# Altium schematic sheet ethernet.SchDoc: Ethernet
size A3; Organization: Tweetonig; Address1: Delftsestraat 11; DocumentNumber: 7; Revision: 1.0; SheetNumber: 7; SheetTotal: 9
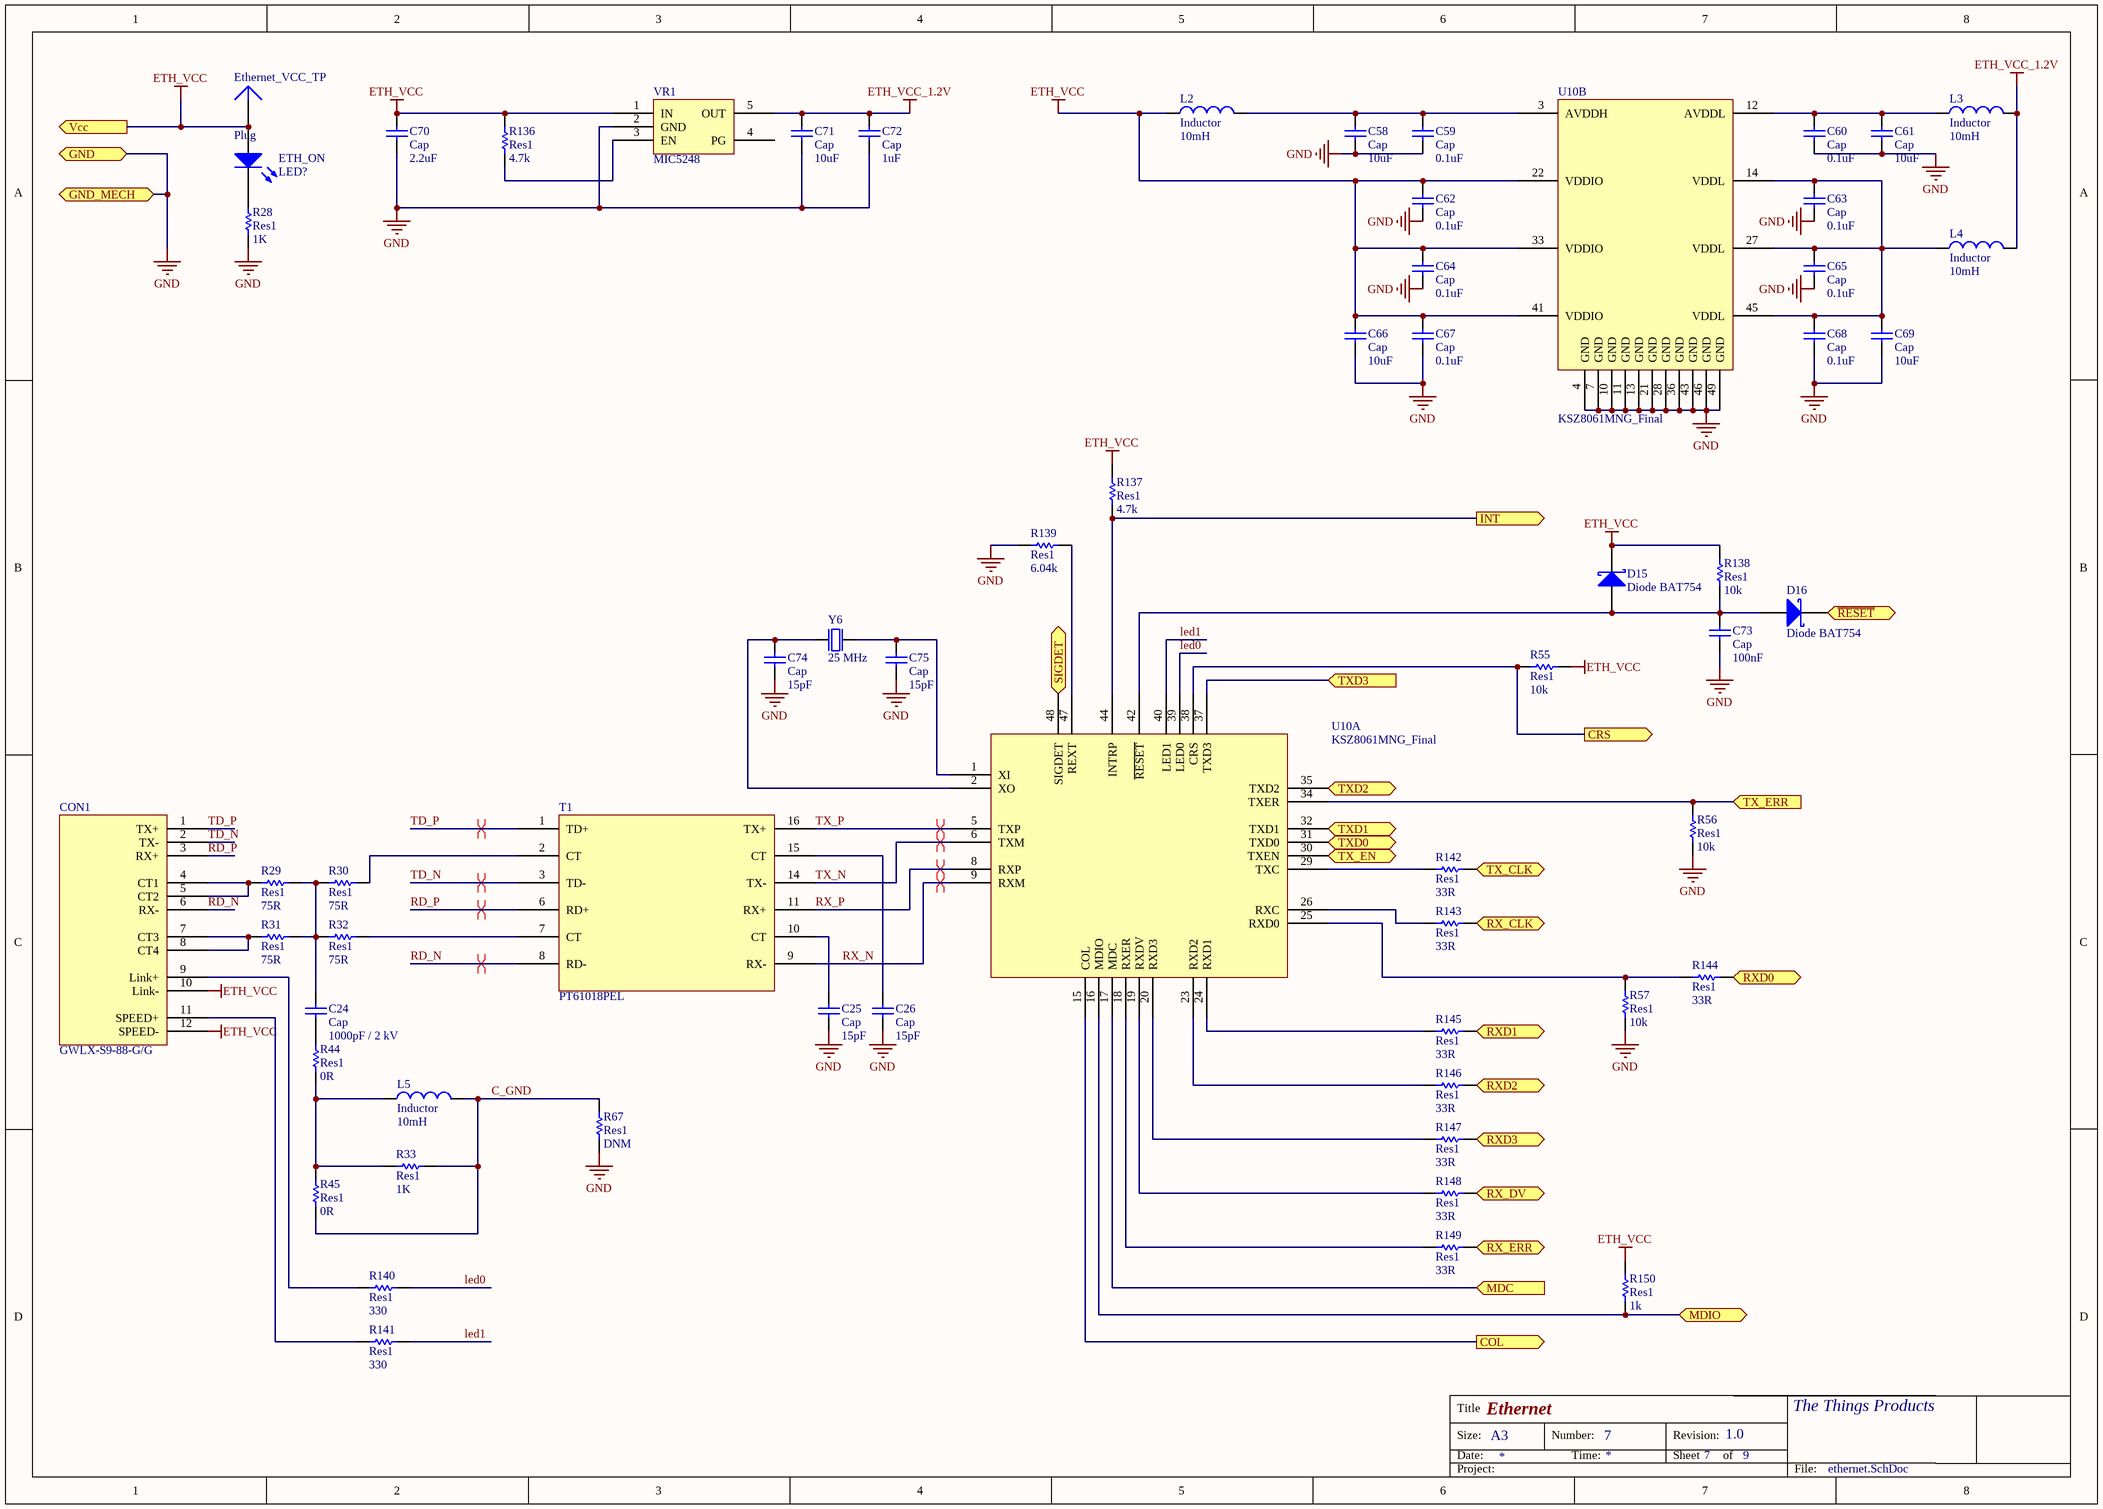
[diagram p0: ethernet.SchDoc]

## Parts
C24  Cap  value 1000pF / 2 kV  [CAP HV 5-7.5mm]
C25  Cap  value 15pF  [C0603]
C26  Cap  value 15pF  [C0603]
C58  Cap  value 10uF  [C0603]
C59  Cap  value 0.1uF  [C0603]
C60  Cap  value 0.1uF  [C0603]
C61  Cap  value 10uF  [C0603]
C62  Cap  value 0.1uF  [C0603]
C63  Cap  value 0.1uF  [C0603]
C64  Cap  value 0.1uF  [C0603]
C65  Cap  value 0.1uF  [C0603]
C66  Cap  value 10uF  [C0603]
C67  Cap  value 0.1uF  [C0603]
C68  Cap  value 0.1uF  [C0603]
C69  Cap  value 10uF  [C0603]
C70  Cap  value 2.2uF  [C0603]
C71  Cap  value 10uF  [C0603]
C72  Cap  value 1uF  [C0603]
C73  Cap  value 100nF  [C0603]
C74  Cap  value 15pF  [C0603]
C75  Cap  value 15pF  [C0603]
CON1  GWLX-S9-88-G/G  [GWLX-S9-88-G/G]
D15  Diode BAT754  [SOT-23_N]
D16  Diode BAT754  [SOT-23_N]
ETH_ON  LED?  [C0603]
Ethernet_VCC_TP  Plug  [PIN1]
L2  Inductor  value 10mH  [6-0805_L]
L3  Inductor  value 10mH  [6-0805_L]
L4  Inductor  value 10mH  [6-0805_L]
L5  Inductor  value 10mH  [6-0805_L]
R28  Res1  value 1K  [R0603]
R29  Res1  value 75R  [R0603]
R30  Res1  value 75R  [R0603]
R31  Res1  value 75R  [R0603]
R32  Res1  value 75R  [R0603]
R33  Res1  value 1K  [R0603]
R44  Res1  value 0R  [R0603]
R45  Res1  value 0R  [R0603]
R55  Res1  value 10k  [R0603]
R56  Res1  value 10k  [R0603]
R57  Res1  value 10k  [R0603]
R67  Res1  value DNM  [R0603]
R136  Res1  value 4.7k  [R0603]
R137  Res1  value 4.7k  [R0603]
R138  Res1  value 10k  [R0603]
R139  Res1  value 6.04k  [R0603]
R140  Res1  value 330  [R0603]
R141  Res1  value 330  [R0603]
R142  Res1  value 33R  [R0603]
R143  Res1  value 33R  [R0603]
R144  Res1  value 33R  [R0603]
R145  Res1  value 33R  [R0603]
R146  Res1  value 33R  [R0603]
R147  Res1  value 33R  [R0603]
R148  Res1  value 33R  [R0603]
R149  Res1  value 33R  [R0603]
R150  Res1  value 1k  [R0603]
T1  PT61018PEL  [WSOIC16_L]
U10  KSZ8061MNG_Final  (parts A,B of 2)
VR1  MIC5248  [SOT23-5_L]
Y6  25 MHz  [Crystal - ABM3B]

## Ports
COL (out), CRS (out), GND (bidir), GND_MECH (bidir), INT (out), MDC (in), MDIO, RX_CLK (out), RX_DV (out), RX_ERR (out), RXD0 (out), RXD1 (out), RXD2 (out), RXD3 (out), SIGDET (out), TX_CLK (out), TX_EN (in), TX_ERR (in), TXD0 (in), TXD1 (in), TXD2 (in), TXD3 (in), Vcc (out), ~{RESET}

## Nets
ETH_VCC: C62.2 C64.2 C66.2 C67.2 C70.2 CON1.10(Link-) CON1.12(SPEED-) D15.3(K) ETH_ON.1(A) Ethernet_VCC_TP.1 L2.1 R55.1 R136.2 R137.2 R138.2 R150.2 U10.22(VDDIO) U10.33(VDDIO) U10.41(VDDIO) VR1.1(IN) ; port Vcc
ETH_VCC_1.2V: C71.2 C72.2 L3.2 L4.2 VR1.5(OUT)
GND: C25.1 C26.1 C58.1 C59.1 C60.1 C61.1 C62.1 C63.1 C64.1 C65.1 C66.1 C67.1 C68.1 C69.1 C70.1 C71.1 C72.1 C73.1 C74.1 C75.1 R28.1 R56.1 R57.1 R67.2 R139.1 U10.4(GND) U10.7(GND) U10.10(GND) U10.11(GND) U10.13(GND) U10.21(GND) U10.28(GND) U10.36(GND) U10.43(GND) U10.46(GND) U10.49(GND) VR1.2(GND) Y6.2(GND) Y6.4(GND) ; port GND, port GND_MECH
~{RESET}: D16.3(K) ; port ~{RESET}
C_GND: L5.2 R33.2 R45.2 R67.1
COL: U10.15(COL) ; port COL
CRS: R55.2 U10.38(CRS) ; port CRS
INT: R137.1 U10.44(INTRP) ; port INT
led0: R140.1 U10.39(LED0)
led1: R141.1 U10.40(LED1)
MDC: U10.17(MDC) ; port MDC
MDIO: R150.1 U10.16(MDIO) ; port MDIO
RD_N: CON1.6(RX-) T1.8(RD-)
RD_P: CON1.3(RX+) T1.6(RD+)
RX_CLK: R143.1 ; port RX_CLK
RX_DV: R148.1 ; port RX_DV
RX_ERR: R149.1 ; port RX_ERR
RX_N: T1.9(RX-) U10.9(RXM)
RX_P: T1.11(RX+) U10.8(RXP)
RXD0: R144.1 ; port RXD0
RXD1: R145.1 ; port RXD1
RXD2: R146.1 ; port RXD2
RXD3: R147.1 ; port RXD3
SIGDET: U10.48(SIGDET) ; port SIGDET
TD_N: CON1.2(TX-) T1.3(TD-)
TD_P: CON1.1(TX+) T1.1(TD+)
TX_CLK: R142.1 ; port TX_CLK
TX_EN: U10.30(TXEN) ; port TX_EN
TX_ERR: R56.2 U10.34(TXER) ; port TX_ERR
TX_N: T1.14(TX-) U10.6(TXM)
TX_P: T1.16(TX+) U10.5(TXP)
TXD0: U10.31(TXD0) ; port TXD0
TXD1: U10.32(TXD1) ; port TXD1
TXD2: U10.35(TXD2) ; port TXD2
TXD3: U10.37(TXD3) ; port TXD3
NetC24_1: C24.1 R44.1
NetC24_2: C24.2 R29.2 R30.1 R31.2 R32.1
NetC25_2: C25.2 T1.10(CT)
NetC26_2: C26.2 T1.15(CT)
NetC58_2: C58.2 C59.2 L2.2 U10.3(AVDDH)
NetC60_2: C60.2 C61.2 L3.1 U10.12(AVDDL)
NetC63_2: C63.2 C65.2 C68.2 C69.2 L4.1 U10.14(VDDL) U10.27(VDDL) U10.45(VDDL)
NetC73_2: C73.2 D15.1(A) D16.1(A) R138.1 U10.42(~{RESET})
NetC74_2: C74.2 U10.2(XO) Y6.1(inp)
NetC75_2: C75.2 U10.1(XI) Y6.3(out)
NetCON1_4: CON1.4(CT1) CON1.5(CT2) R29.1
NetCON1_7: CON1.7(CT3) CON1.8(CT4) R31.1
NetCON1_9: CON1.9(Link+) R140.2
NetCON1_11: CON1.11(SPEED+) R141.2
NetETH_ON_2: ETH_ON.2(K) R28.2
NetL5_1: L5.1 R33.1 R44.2 R45.1
NetR30_2: R30.2 T1.2(CT)
NetR32_2: R32.2 T1.7(CT)
NetR57_2: R57.2 R144.2 U10.25(RXD0)
NetR136_1: R136.1 VR1.3(EN)
NetR139_2: R139.2 U10.47(REXT)
NetR142_2: R142.2 U10.29(TXC)
NetR143_2: R143.2 U10.26(RXC)
NetR145_2: R145.2 U10.24(RXD1)
NetR146_2: R146.2 U10.23(RXD2)
NetR147_2: R147.2 U10.20(RXD3)
NetR148_2: R148.2 U10.19(RXDV)
NetR149_2: R149.2 U10.18(RXER)

Not connected (* = marked no-connect by the designer): VR1 4(PG)

## Layout directives
differential pair: RD_N, RD_P, RX_N, RX_P, TD_N, TD_P, TX_N, TX_P

## Notes on the sheet
- Title
- Size:
- Date:
- A3
- Number:
- Time:
- Revision:
- Sheet
- of
- The Things Products
- Project:
- File:

## Library data of the parts
C24-C26 C58-C75 = Cap: Capacitor; Published: 8-Jun-2000; LatestRevisionDate: 17-Jul-2002; LatestRevisionNote: Re-released for DXP Platform.; PackageReference: RAD-0.3; Publisher: Altium Limited; PackageDescription: Radial Cap, Thru-Hole; 2 Leads; 0.3 in Pin Spacing
CON1 = GWLX-S9-88-G/G: GWLX-S9-88-G/G Ethernet Jack w/Leds
D15 D16 = Diode BAT17: Silicon RF Schottky Diode for Mixer Applications in the VHF/UHF Range; Note: Pin 2 is not connected and not drawn.; Published: 21-Mar-2003; LatestRevisionDate: 29-May-2009; LatestRevisionNote: IPC-7351 Footprint Added.; DatasheetVersion: Oct-1999; PackageVersion: Sep-2001; PackageReference: SOT-23; Publisher: Altium Limited; PackageDescription: 3-Pin SOT-23 Package 0.95 mm Pitch, 2.5 mm Lead Span; ComponentLink1Description: Manufacturer Link; ComponentLink1URL: http://www.infineon.com/; ComponentLink2Description: Datasheet; ComponentLink2URL: http://www.infineon.com/upload/Document/cmc_upload/documents/009/363/bat17series.pdf
ETH_ON = LED0: Typical INFRARED GaAs LED; Published: 8-Jun-2000; LatestRevisionDate: 08-Jul-2005; LatestRevisionNote: Mech Layer 1 removed.; PackageReference: LED-0; Publisher: Altium Limited; PackageDescription: LED; 2 Leads
L2-L5 = Inductor: Code_IEC: 1005; Published: 8-Jun-2000; LatestRevisionDate: 29-May-2009; LatestRevisionNote: IPC-7351 Footprint Added.; PackageReference: 0402-A; Publisher: Altium Limited; PackageDescription: Chip Inductor; Code_JEITA: 0402
R28-R33 R44 R45 R55-R57 R67 R136-R150 = Res1: Resistor; Published: 8-Jun-2000; LatestRevisionDate: 17-Jul-2002; LatestRevisionNote: Re-released for DXP Platform.; PackageReference: AXIAL-0.3; Publisher: Altium Limited; PackageDescription: Axial Device, Thru-Hole; 2 Leads; 0.3 in Pin Spacing
T1 = PT61018PEL: PT61018PEL - Ethernet Transformer
U10 = KSZ8061MNG_Final: Micrel KSZ8061MNG PHY-Ethernet Tranceiver
VR1 = MIC5248-x.xYM5: Microchip MIC5248 Regulator
Y6 = NX2520SA-16MHZ-STD-CSW-5: XTAL SMD 2520, 16MHz, 8pF, ±15ppm; Manufacturer: NDK; Note: XTAL SMD 16.000MHz; Artikkelnr Noca: 22019192; Artikkelnr Simpro: N.A.; Part Number: NX2520SA-16MHZ-STD-CSW-5; Manufacturer Part Number: NX2520SA-16MHZ-STD-CSW-5; Datasheet: http://www.ndk.com/images/products/catalog/c_NX2520SA-STD-CSW-5_e.pdf; LatestRevisionDate: 2012-06-15; Pin Count: 4; Publisher: Nordic Semiconductor; Published: 2012-06-15; Value: 16MHz; Supplier: Digi-Key; Supplier part number: 644-1169-1-ND; 2nd source Supplier: *; 2nd source part number: *; Footprint Doc: BT-XTAL_2520
Ethernet_VCC_TP = Plug: LatestRevisionDate: 17-Jul-2002; LatestRevisionNote: Re-released for DXP Platform.; Publisher: Altium Limited